# Altium schematic sheet bluetooth.SchDoc
size A4
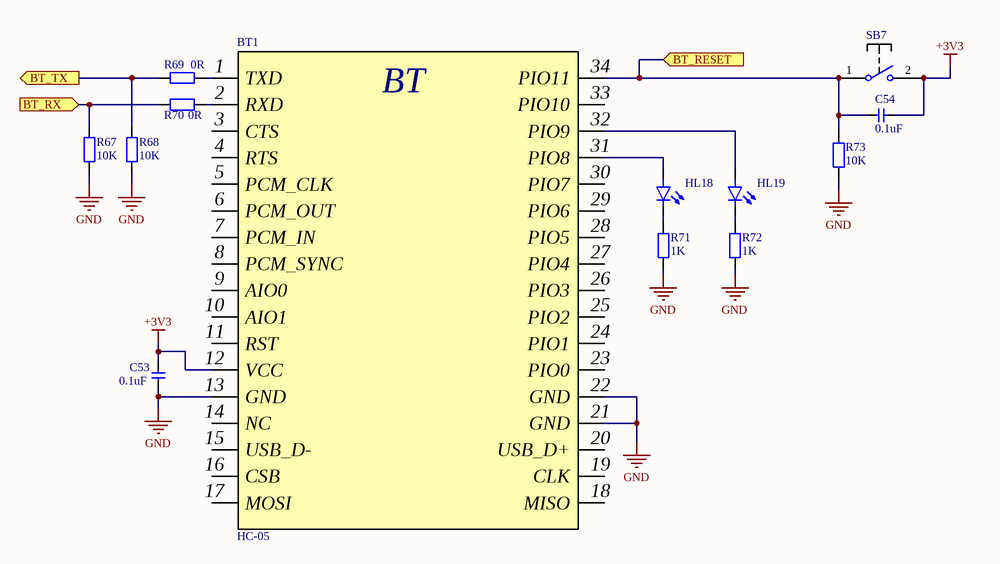
[diagram p0: bluetooth.SchDoc]

## Parts
BT1  HC-05  [HC-05]
C53  0.1uF  [CAP0805]
C54  0.1uF  [CAP0805]
HL18  White  [LED0603_WHITE]  (value not drawn)
HL19  White  [LED0603_WHITE]  (value not drawn)
R67  10K  [RES0805]
R68  10K  [RES0805]
R69  0R  [RES0805]
R70  0R  [RES0805]
R71  1K  [RES0805]
R72  1K  [RES0805]
R73  10K  [RES0805]
SB7  TACT 6.0 X 3.5  [PTS636 SP43 LFS]  (value not drawn)

## Ports
BT_RESET (in), BT_RX (in), BT_TX (out)

## Nets
+3V3: BT1.12(VCC) C53.2 C54.1 SB7.2(NO)
GND: BT1.13(GND) BT1.21(GND) BT1.22(GND) C53.1 R67.1 R68.1 R71.1 R72.1 R73.1
BT_RESET: BT1.34(PIO11) C54.2 R73.2 SB7.1(COMMON) ; port BT_RESET
BT_RX: R67.2 R70.2 ; port BT_RX
BT_TX: R68.2 R69.2 ; port BT_TX
NetBT1_1: BT1.1(TXD) R69.1
NetBT1_2: BT1.2(RXD) R70.1
NetBT1_31: BT1.31(PIO8) HL18.2(A)
NetBT1_32: BT1.32(PIO9) HL19.2(A)
NetHL18_1: HL18.1(K) R71.2
NetHL19_1: HL19.1(K) R72.2

Not connected (* = marked no-connect by the designer): BT1 3(CTS) 4(RTS) 5(PCM_CLK) 6(PCM_OUT) 7(PCM_IN) 8(PCM_SYNC) 9(AIO0) 10(AIO1) 11(RST) 14(NC) 15(USB_D-) 16(CSB) 17(MOSI) 18(MISO) 19(CLK) 20(USB_D+) 23(PIO0) 24(PIO1) 25(PIO2) 26(PIO3) 27(PIO4) 28(PIO5) 29(PIO6) 30(PIO7) 33(PIO10)

## Notes on the sheet
- (in symbol HC-05) BT

## Library data of the parts
BT1 = HC-05: Bluetooth; ComponentLink1Description: Chipdip; ComponentLink1URL: https://www.chipdip.ru/product0/8020390968
C53 C54 = CAP Ceramic: Ceramic SMD Cap
HL18 HL19 = LED: SMD LED
R67-R73 = RES: RES smd
SB7 = PTS636 SP43 LFS: Button; Part Number: PTS636 SP43 LFS; HelpURL: https://www.digikey.com/product-detail/en/c-k/PTS636-SP43-LFS/CKN12304-ND/10071717; Digi-Key Part Number: CKN12304-ND; Price$: 0.1; Manufacturer Part Number: PTS636 SP43 LFS